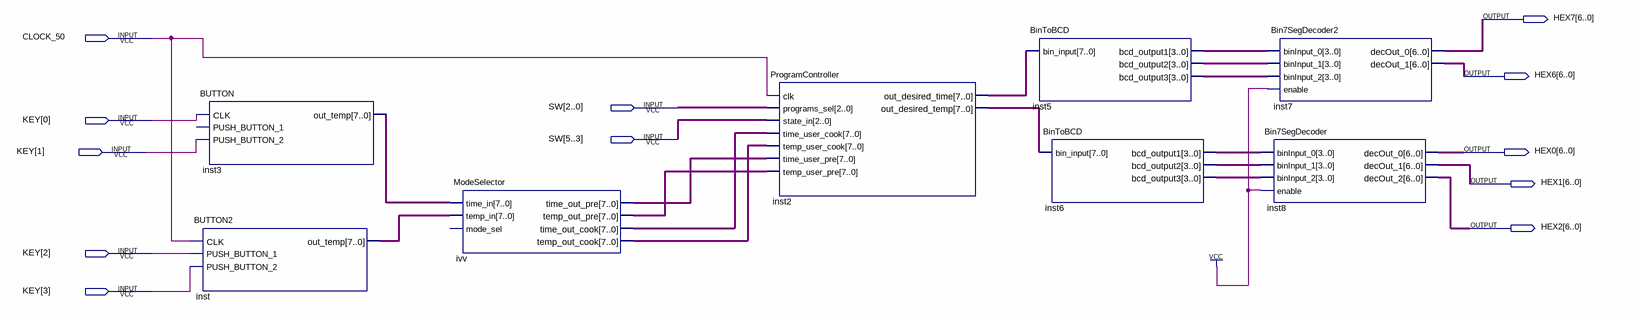
[diagram p0: schematic sheet]
// Quartus schematic User_cook_demo.bdf as structural Verilog: 8 symbols, 12 pins
module User_cook_demo (
  input  CLOCK_50,
  input  [5:0] SW,
  input  [3:0] KEY,
  output [6:0] HEX7,
  output [6:0] HEX6,
  output [6:0] HEX0,
  output [6:0] HEX1,
  output [6:0] HEX2
);

  wire [3:0] inst5_bcd_output1, inst5_bcd_output2, inst5_bcd_output3, inst6_bcd_output1, inst6_bcd_output2,
       inst6_bcd_output3;
  wire [7:0] inst2_out_desired_temp, inst2_out_desired_time, inst3_out_temp, inst_out_temp,
       ivv_temp_out_cook, ivv_temp_out_pre, ivv_time_out_cook, ivv_time_out_pre;

  BUTTON inst3 (.CLK(KEY[0]), .PUSH_BUTTON_2(KEY[1]), .out_temp(inst3_out_temp));  // open: PUSH_BUTTON_1
  BUTTON2 inst (.CLK(CLOCK_50), .PUSH_BUTTON_1(KEY[2]), .PUSH_BUTTON_2(KEY[3]), .out_temp(inst_out_temp));
  ModeSelector ivv (
    .time_in(inst3_out_temp), .temp_in(inst_out_temp), .time_out_pre(ivv_time_out_pre),
    .temp_out_pre(ivv_temp_out_pre), .time_out_cook(ivv_time_out_cook), .temp_out_cook(ivv_temp_out_cook));  // open: mode_sel
  ProgramController inst2 (
    .clk(CLOCK_50), .programs_sel(SW[2:0]), .state_in(SW[5:3]), .time_user_cook(ivv_time_out_cook),
    .temp_user_cook(ivv_temp_out_cook), .time_user_pre(ivv_time_out_pre), .temp_user_pre(ivv_temp_out_pre),
    .out_desired_time(inst2_out_desired_time), .out_desired_temp(inst2_out_desired_temp));
  BinToBCD inst5 (
    .bin_input(inst2_out_desired_time), .bcd_output1(inst5_bcd_output1), .bcd_output2(inst5_bcd_output2),
    .bcd_output3(inst5_bcd_output3));
  BinToBCD inst6 (
    .bin_input(inst2_out_desired_temp), .bcd_output1(inst6_bcd_output1), .bcd_output2(inst6_bcd_output2),
    .bcd_output3(inst6_bcd_output3));
  Bin7SegDecoder2 inst7 (
    .binInput_0(inst5_bcd_output1), .binInput_1(inst5_bcd_output2), .binInput_2(inst5_bcd_output3),
    .enable(1'b1), .decOut_0(HEX7), .decOut_1(HEX6));
  Bin7SegDecoder inst8 (
    .binInput_0(inst6_bcd_output1), .binInput_1(inst6_bcd_output2), .binInput_2(inst6_bcd_output3),
    .enable(1'b1), .decOut_0(HEX0), .decOut_1(HEX1), .decOut_2(HEX2));
endmodule
